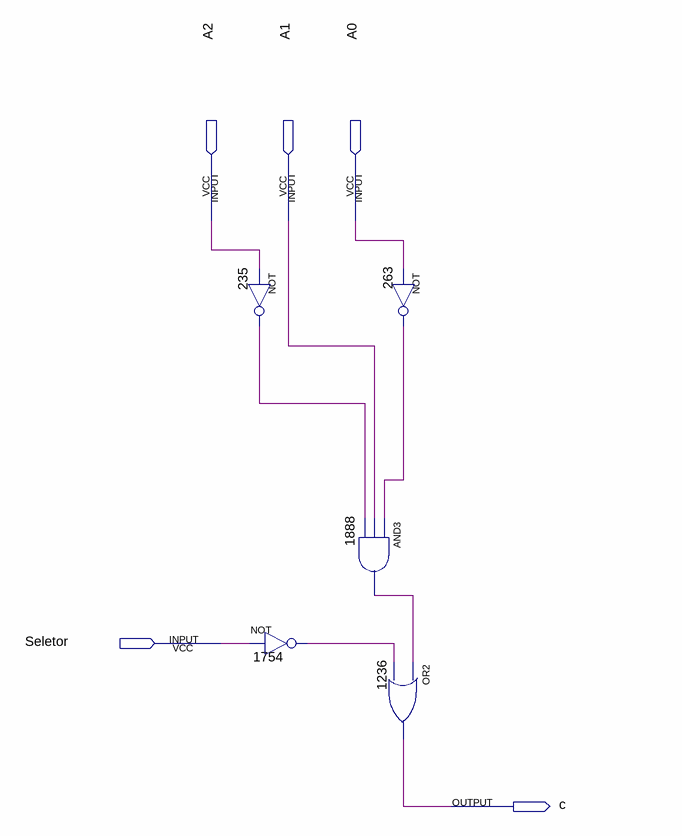
[diagram p0: schematic sheet]
// Quartus schematic segmento_c.bdf as structural Verilog: 5 symbols, 5 pins
module segmento_c (
  input  A2,
  input  A1,
  input  A0,
  input  Seletor,
  output c
);

  wire n235_out, n263_out, n1754_out, n1888_out;

  not u_235 (n235_out, A2);
  not u_1754 (n1754_out, Seletor);
  and u_1888 (n1888_out, n263_out, A1, n235_out);
  not u_263 (n263_out, A0);
  or u_1236 (c, n1888_out, n1754_out);
endmodule
